# Altium project LEDShield.PrjPcb
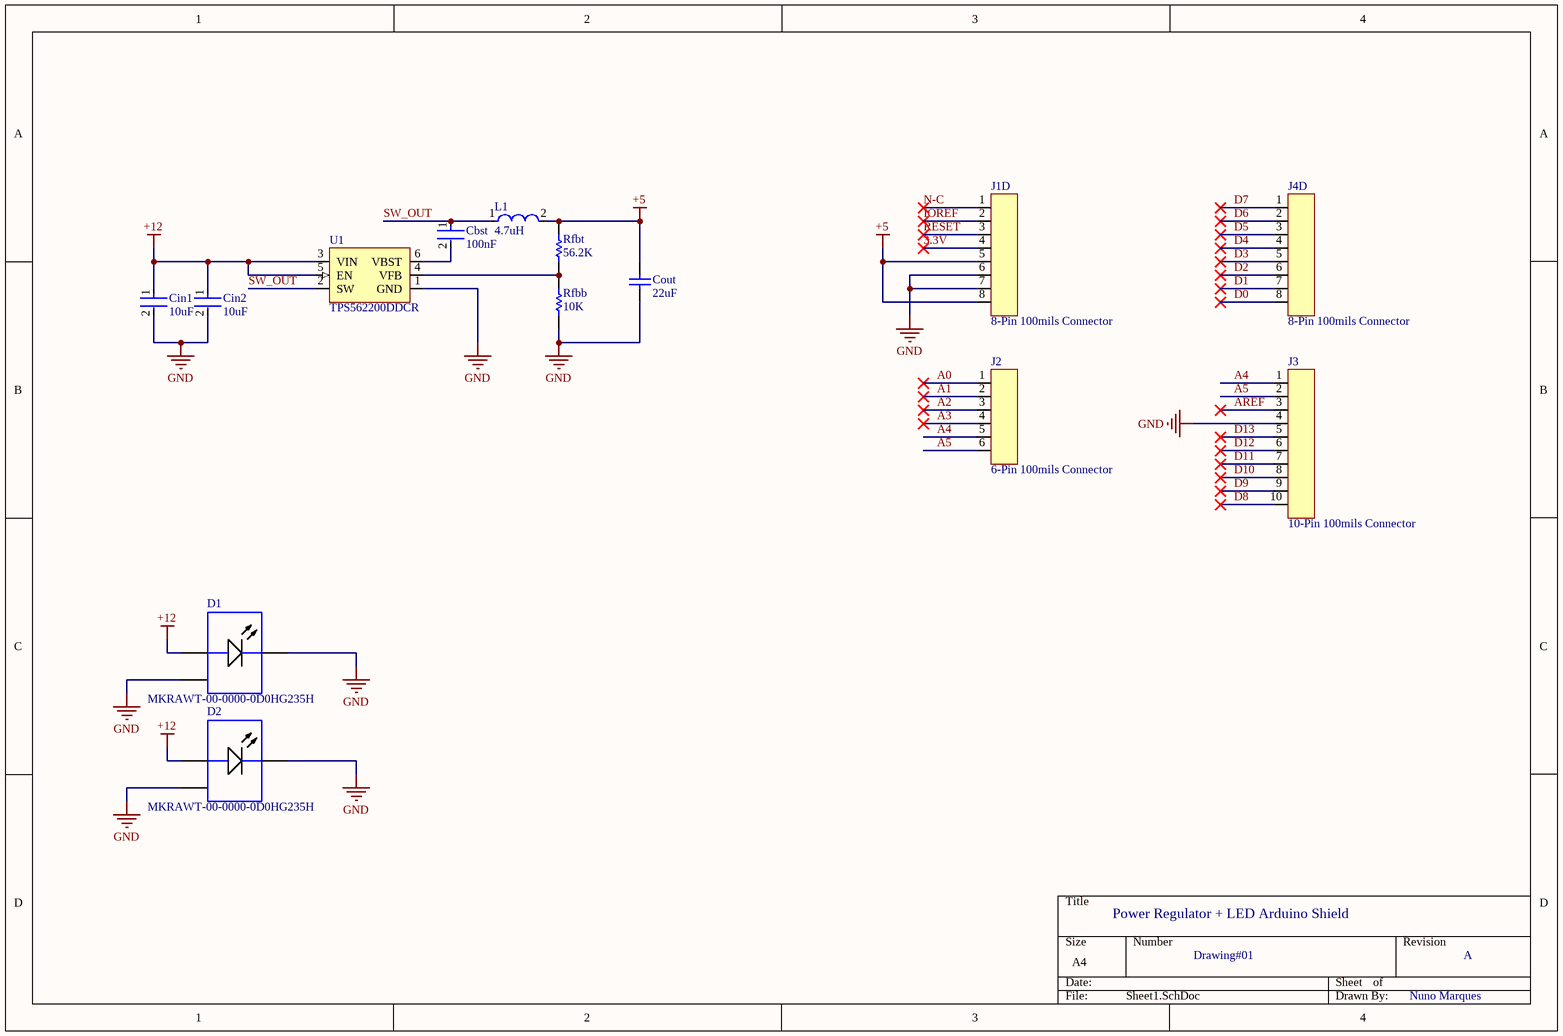
[diagram p0: Sheet1.SchDoc]
1 sheet, 14 parts. Net scope: global (net labels, ports and power ports of the same name join across sheets).
Board file: PCB1.PcbDoc

## Sheet Sheet1.SchDoc
size A4; SheetNumber: 1; SheetTotal: 1

### Parts
Cbst  100nF  [FP-0805-L_2_01_0_2-W_1_25-IPC_C]
Cin1  10uF  [FP-C2012-125-0_2-IPC_B]
Cin2  10uF  [FP-C2012-125-0_2-IPC_B]
Cout  22uF  [CAPC1608X100X20ML10]
D1  MKRAWT-00-0000-0D0HG235H  [CREE-MK-R-2_V]
D2  MKRAWT-00-0000-0D0HG235H  [CREE-MK-R-2_V]
J1  8-Pin 100mils Connector  [SSQ-108-03-T-S]  (part D of 4)
J2  6-Pin 100mils Connector  [SSQ-106-03-T-S]
J3  10-Pin 100mils Connector  [SSQ-110-03-T-S]
J4  8-Pin 100mils Connector  [SSQ-108-03-T-S]  (part D of 4)
L1  4.7uH  [FP-NRS8030-MFG]
Rfbb  10K  [RESC0201(0603)_N]
Rfbt  56.2K  [RESC0603X28X15NL05T05]
U1  TPS562200DDCR  [TPS562200DDCR]

### Nets
+5: Cout.2 J1.5 J1.8 L1.2 Rfbt.2
+12: Cin1.1 Cin2.1 D1.1(A) D2.1(A) U1.3(VIN) U1.5(EN)
GND: Cin1.2 Cin2.2 Cout.1 D1.2(K) D1.3(EP) D2.2(K) D2.3(EP) J1.6 J1.7 J3.4 Rfbb.1 U1.1(GND)
3.3V: J1.4
A0: J2.1
A1: J2.2
A2: J2.3
A3: J2.4
A4: J2.5 J3.1
A5: J2.6 J3.2
AREF: J3.3
D0: J4.8
D1: J4.7
D2: J4.6
D3: J4.5
D4: J4.4
D5: J4.3
D6: J4.2
D7: J4.1
D8: J3.10
D9: J3.9
D10: J3.8
D11: J3.7
D12: J3.6
D13: J3.5
IOREF: J1.2
N-C: J1.1
RESET: J1.3
SW_OUT: Cbst.1 L1.1 U1.2(SW)
NetCbst_2: Cbst.2 U1.6(VBST)
NetRfbb_2: Rfbb.2 Rfbt.1 U1.4(VFB)

### Notes on the sheet
- Power Regulator + LED Arduino Shield
- Drawing#01
- A
- Nuno Marques

### Library data of the parts
Cbst = CMP-2000-05014-2: General Purpose Ceramic Capacitor, 0805, 100nF, 10%, X7R, 0.15, 25V; Dissipation Factor: 3%; Insulation Resistance: 100GR; Tolerance: 10%; Height: 0.94mm; Case/Package: 0805; Case Code (Imperial): 0805; Number of Pins: 2; Termination: SMD/SMT; Case Code (Metric): 2012; Depth: 1.25mm; Min Operating Temperature: -55°C; Radiation Hardening: No; Max Operating Temperature: 125°C; Length: 2.01mm; Thickness: 0.037inch; Series: -; Dielectric: X7R; Voltage Rating (DC): 25V; Packaging: Tape and Reel; Width: 0.049inch; Capacitance: 100nF; Construction: Flat; Voltage: 25V; RoHS Compliant: Yes; REACH SVHC: No SVHC; Package Quantity: 1; Voltage Rating: 25V; Mount: Surface Mount; Lead Free: Lead Free; Contact Plating: Tin
Cin1 Cin2 = CMP-08246-003791-1: Multilayer Ceramic Capacitors 10μF ±20% 35V X5R SMD 0805; Tolerance: 20%; Package Quantity: 2000; Dielectric Material: Ceramic; Case Code (Imperial): 0805; Lead Free: Lead Free; Voltage Rating (DC): 35V; Max Operating Temperature: 85°C; Series: C; Voltage Rating: 35V; Packaging: Tape and Reel; Mount: Surface Mount; Case Code (Metric): 2012; Case/Package: 0805; Width: 0.049inch; RoHS Compliant: Yes; Length: 0.079inch; Thickness: 0.057inch; Min Operating Temperature: -55°C; Capacitance: 10uF
Cout = CMP-2000-05441-1: Chip Capacitor, 22 uF, +/- 20%, 10 V, -55 to 85 degC, 0603 (1608 Metric), RoHS, Tape and Reel; Manufacturer: TDK; PCN Part Number: MLCCPartNumberChange30/Nov/2012; Voltage - Rated: 10V; Product Training Modules: CSeriesGeneralApplicationsSEAT,CCV,andTVCLDesignToolsGuidetoReplacinganElectrolyticCapacitorwithanMLCC; Other Names: 445-9077-1; Design Resources: 20WNon-IsolatedBuckLEDDriverUsingPLLNK460KG; Online Catalog: CSeries,GeneralPurpose; Capacitance: 22µF; Temperature Coefficient: X5R; Kits: 445-9014-KIT-ND-KITMLCC100PF-22UF060310-50V; Packaging: CutTape(CT); Standard Package: 1; Package / Case: 0603(1608Metric); Lead Style: -; Features: -; Ratings: -; Operating Temperature: -55degC~85degC; Applications: GeneralPurpose; Package Reference: 603; Datasheet URL: http://download.siliconexpert.com/pdfs/2015/4/21/15/54/45/779/tdk_/manual/37024850441143360mlcc_commercial_general_en.pdf; Datasheet Version: Mar-15; Mounting Type: SurfaceMount,MLCC; Lead Spacing: -; Size / Dimension: 0.063"Lx0.031"W(1.60mmx0.80mm); Height - Seated (Max): -; Package Description: 2-Pin Surface Mount Device, Body 1.6 x 0.8 mm; Manufacturer URL: http://www.tdk.com/; RoHS Information: RoHSCertificate-MLCC; Tolerance: ±20%; Series: C; Thickness (Max): 0.035"(0.90mm); Family: CeramicCapacitors; Category: Capacitors
D1 D2 = CMP-2100-00977-1: LED, White, 12 V, 2-Pin SMD, RoHS, Tape and Reel
J1 J4 = SSQ-108-03-T-S: 8-Pin Arduino Connector
J2 = SSQ-106-03-T-S: 6-Pin Arduino Connector
J3 = SSQ-110-03-T-S: 10-Pin Arduino Connector
L1 = CMP-14484-001135-1: Inductor Power Shielded Wirewound 4.7uH 20% 100KHz Ferrite 3.6A 28.6mΩ DCR T/R; Self Resonant Frequency: 40MHz; RMS Current (Irms): 4A; DC Resistance (DCR): 28.6mR; Package Quantity: 1000; Test Frequency: 100kHz; Max DC Current: 3.6A; Width: 0.315inch; Height: 3mm; Length: 8mm; Lead Pitch: 5.6mm; Inductance Tolerance: 20%; Tolerance: 20%; Max Operating Temperature: 125°C; Min Operating Temperature: -25°C; Radiation Hardening: No; Packaging: Tape and Reel; Number of Pins: 2; Case/Package: 8030; Inductance: 4.7uH; Height - Seated (Max): 0.118inch; Shielding: Shielded; Core Material: Ferrite; Series: NRS; RoHS Compliant: Yes; Saturation Current: 3.6A; Termination: SMD/SMT; Current Rating: 4A; Depth: 8.2mm; Mount: Surface Mount; Lead Free: Lead Free; Halogen Free: Halogen Free; Resistor Type: Wirewound
Rfbb = CMP-1010-00529-1: 10K 0.05W 1% 0201 (0603 Metric)  SMD; Value: 10000.00 Ohm; Case-EIA: 0201; Case-Metric: 0603; Tolerance: 1 %; Technology: SMT; Power: 0.05 W
Rfbt = CMP-2004-00723-1: Manufacturer: Vishay Dale; Part Number: CRCW020156K2FNED